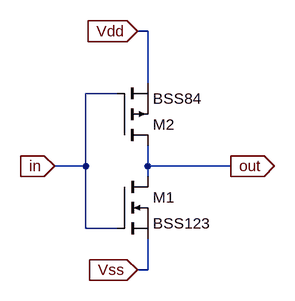
[diagram p0: schematic inverter.asc]
inverter.asc, the LTspice schematic file:
Version 4
SHEET 1 880 680
WIRE 160 -176 144 -176
WIRE 160 -96 160 -176
WIRE 112 -80 64 -80
WIRE 64 32 64 -80
WIRE 64 32 16 32
WIRE 160 32 160 0
WIRE 288 32 160 32
WIRE 160 48 160 32
WIRE 64 128 64 32
WIRE 112 128 64 128
WIRE 160 192 160 144
WIRE 160 192 144 192
FLAG 16 32 in
IOPIN 16 32 In
FLAG 288 32 out
IOPIN 288 32 Out
FLAG 144 192 Vss
IOPIN 144 192 In
FLAG 144 -176 Vdd
IOPIN 144 -176 In
SYMBOL nmos 112 48 R0
SYMATTR InstName M1
SYMATTR Value BSS123
SYMBOL pmos 112 0 M180
SYMATTR InstName M2
SYMATTR Value BSS84

The netlist it stands for:
* inverter.asc
M1 out in Vss Vss BSS123
M2 out in Vdd Vdd BSS84
.model NMOS NMOS
.model PMOS PMOS
.lib standard.mos
.backanno
.end